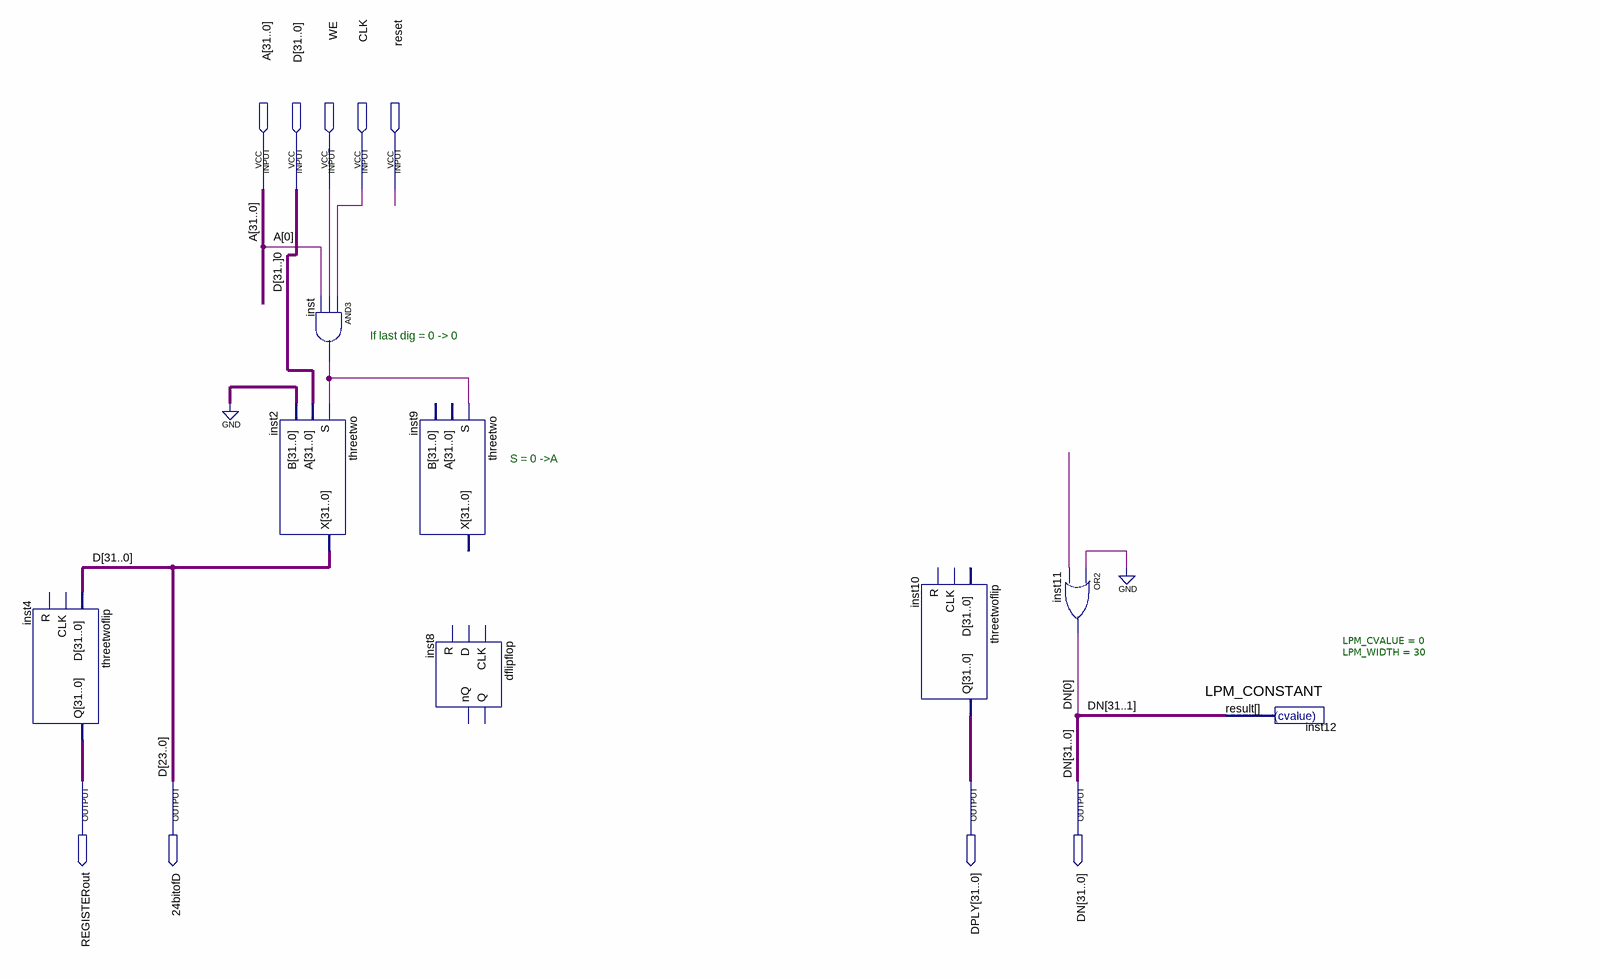
[diagram p0: schematic sheet]
// Quartus schematic source.bdf as structural Verilog: 8 symbols, 9 pins
module source (
  input  [31:0] A,
  input  [31:0] D,
  input  WE,
  input  CLK,
  input  reset,
  output REGISTERout,
  output \24bitofD ,
  output [31:0] DPLY,
  output [31:0] DN
);

  wire \D[31..]0 , inst_out, undriven;
  wire [31:0] inst4_q;

  threetwoflip inst4 (.D(D), .Q(inst4_q));  // open: CLK, R
  threetwo inst2 (.S(inst_out), .A({32{\D[31..]0 }}), .B({32{1'b0}}), .X(D));
  and inst (inst_out, CLK, WE, A[0]);
  threetwo inst9 (.S(inst_out));  // open: A, B, X
  dflipflop inst8 ();  // open: CLK, D, R, Q, nQ
  threetwoflip inst10 (.Q(DPLY));  // open: D, CLK, R
  or inst11 (DN[0], 1'b0, undriven);
  LPM_CONSTANT #(.LPM_CVALUE(0), .LPM_WIDTH(30)) inst12 (.result(DN[31:1]));

  // Notes on the sheet:
  //   If last dig = 0 -> 0
  //   S = 0 ->A
endmodule
